# Altium project Pass_Filter.PrjPcb
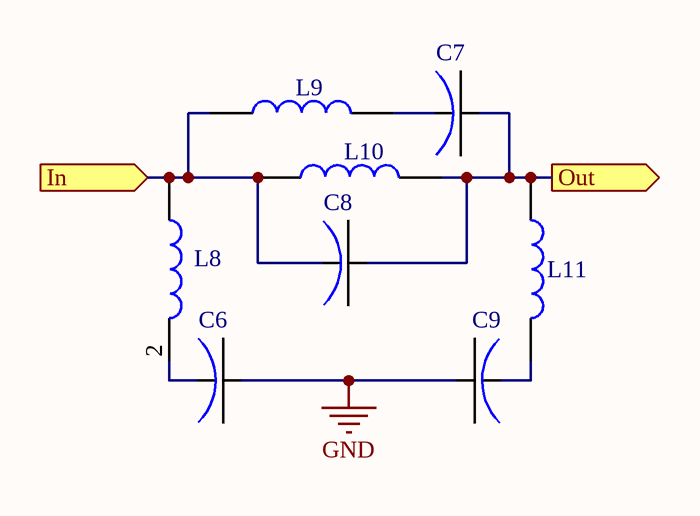
[diagram p0: band-stop_filter.SchDoc]
4 sheets, 26 parts. Net scope: flat (ports and power ports of the same name join across sheets).
Board file: Pass_Filter.PcbDoc
Sheets:
  band-stop_filter.SchDoc
  low_pass_filter.SchDoc
  high_pass_filter.SchDoc
  band_pass_filter.SchDoc

## Sheet band-stop_filter.SchDoc
size A4

### Parts
C6  Cap  [C0805]  (value not drawn)
C7  Cap  [C0603]  (value not drawn)
C8  Cap  [C1206]  (value not drawn)
C9  Cap  [C0805]  (value not drawn)
L8  L1008  [L1008]  (value not drawn)
L9  L1812  [L1812]  (value not drawn)
L10  L1008  [L1008]  (value not drawn)
L11  L1008  [L1008]  (value not drawn)

### Ports
In (in), Out (out)

### Nets
GND: C6.2 C9.2
NetC4_1: C8.1 L8.1 L9.1 L10.1 ; port In
NetC6_1: C6.1 L8.2
NetC7_1: C7.1 L9.2
NetC7_2: C7.2 C8.2 L10.2 L11.1 ; port Out
NetC9_1: C9.1 L11.2

### Library data of the parts
L8 L10 L11 = L1008: Vishay IMC1008E2RJ7
L9 = L1812: Vishay IMC1812ER150J

## Sheet low_pass_filter.SchDoc
size A4
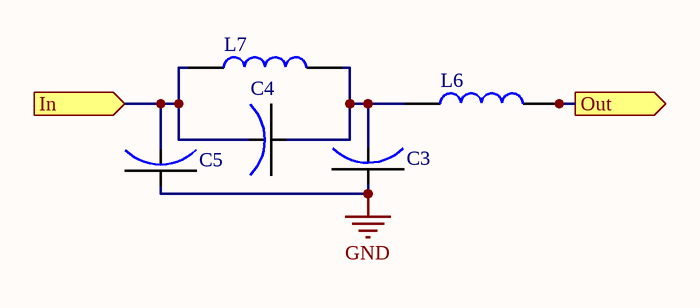
[diagram p1: low_pass_filter.SchDoc]

### Parts
C3  Cap  [C1206]  (value not drawn)
C4  Cap  [C1812]  (value not drawn)
C5  Cap  [C1812]  (value not drawn)
L6  L1812  [L1812]  (value not drawn)
L7  L1812  [L1812]  (value not drawn)

### Ports
In (in), Out (out)

### Nets
GND: C3.2 C5.2
NetC3_1: C3.1 C4.2 L6.1 L7.2
NetC4_1: C4.1 C5.1 L7.1 ; port In
NetC7_2: L6.2 ; port Out

### Library data of the parts
L6 L7 = L1812: Vishay IMC1812ER150J

## Sheet high_pass_filter.SchDoc
size A4
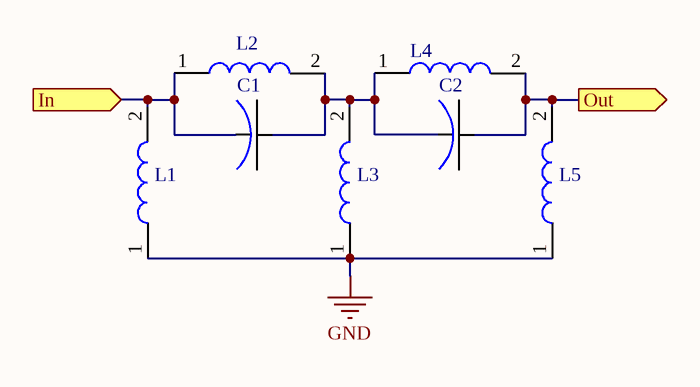
[diagram p2: high_pass_filter.SchDoc]

### Parts
L1  L1008  [L1008]  (value not drawn)
L2  L1812  [L1812]  (value not drawn)
L3  L1008  [L1008]  (value not drawn)
L4  L1812  [L1812]  (value not drawn)
L5  L1008  [L1008]  (value not drawn)
С1  Cap  [C1210]  (value not drawn)
С2  Cap  [C1206]  (value not drawn)

### Ports
In (in), Out (out)

### Nets
GND: L1.1 L3.1 L5.1
NetC4_1: L1.2 L2.1 С1.1 ; port In
NetC7_2: L4.2 L5.2 С2.2 ; port Out
NetL2_2: L2.2 L3.2 L4.1 С1.2 С2.1

### Library data of the parts
L1 L3 L5 = L1008: Vishay IMC1008E2RJ7
L2 L4 = L1812: Vishay IMC1812ER150J

## Sheet band_pass_filter.SchDoc
size A4
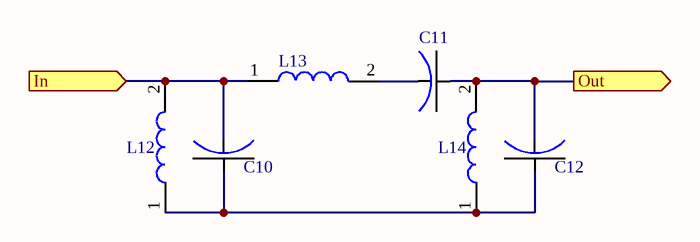
[diagram p3: band_pass_filter.SchDoc]

### Parts
C10  Cap  [C2225]  (value not drawn)
C11  Cap  [C1812]  (value not drawn)
C12  Cap  [C2225]  (value not drawn)
L12  L1008  [L1008]  (value not drawn)
L13  L1008  [L1008]  (value not drawn)
L14  L1008  [L1008]  (value not drawn)

### Ports
In (in), Out (out)

### Nets
NetC4_1: C10.1 L12.2 L13.1 ; port In
NetC7_2: C11.2 C12.1 L14.2 ; port Out
NetC10_2: C10.2 C12.2 L12.1 L14.1
NetC11_1: C11.1 L13.2

### Library data of the parts
L12-L14 = L1008: Vishay IMC1008E2RJ7

## Nets that join several sheets
GND: band-stop_filter (C6.2 C9.2), low_pass_filter (C3.2 C5.2), high_pass_filter (L1.1 L3.1 L5.1)
NetC4_1: band-stop_filter (C8.1 L8.1 L9.1 L10.1), low_pass_filter (C4.1 C5.1 L7.1), high_pass_filter (L1.2 L2.1 С1.1), band_pass_filter (C10.1 L12.2 L13.1)
NetC7_2: band-stop_filter (C7.2 C8.2 L10.2 L11.1), low_pass_filter (L6.2), high_pass_filter (L4.2 L5.2 С2.2), band_pass_filter (C11.2 C12.1 L14.2)